# EAGLE board RectangularThing R2 (EAGLE 7.7.0)
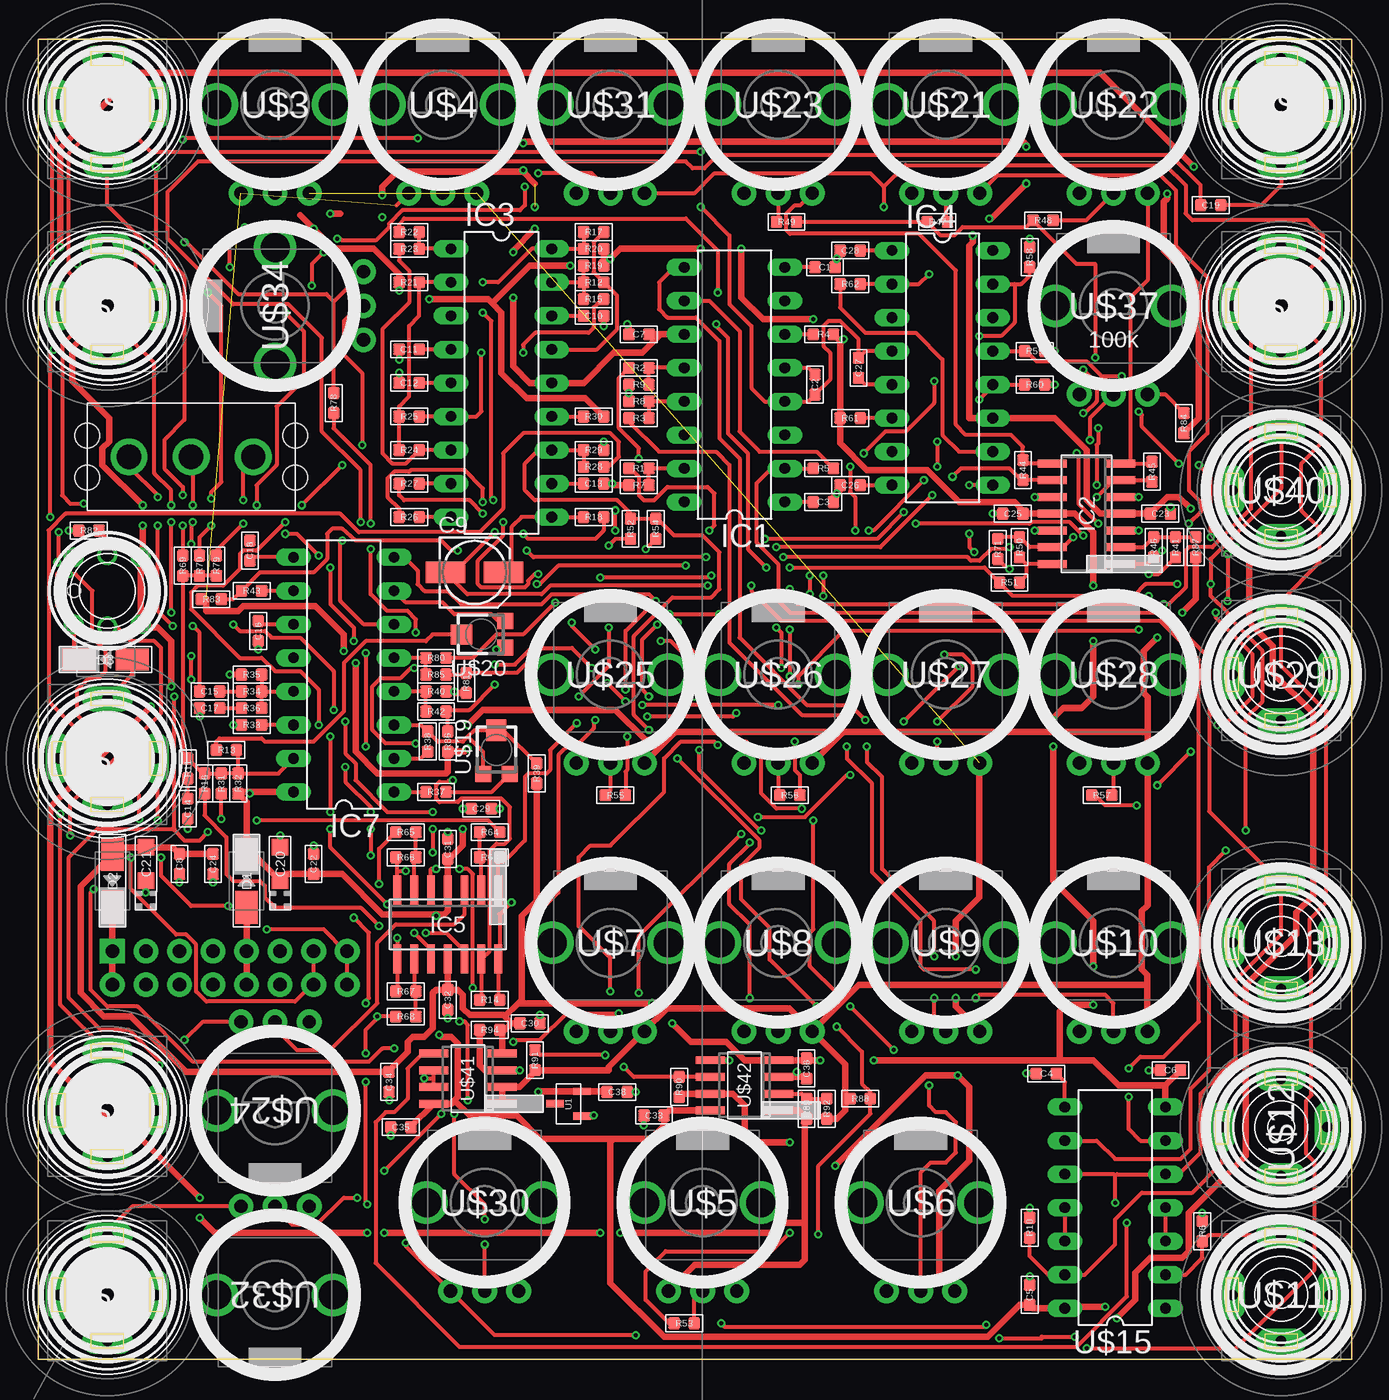
[diagram p6: board, top side]
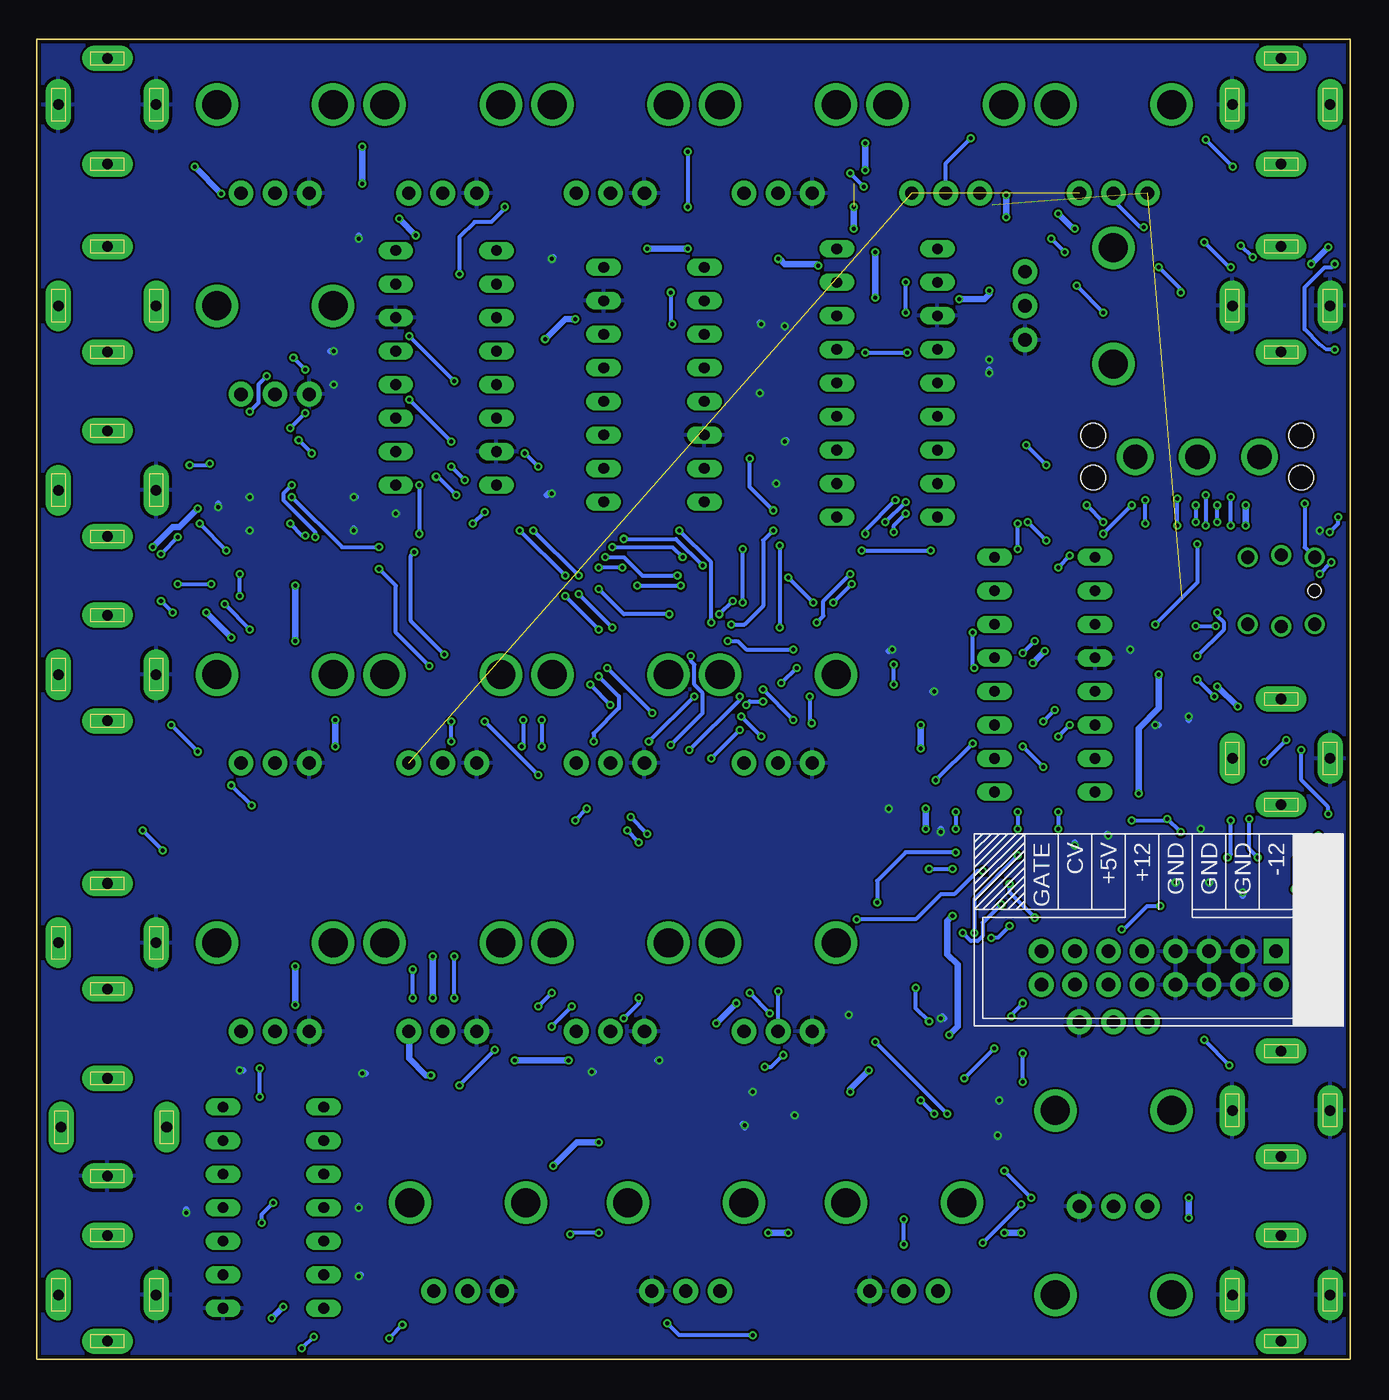
[diagram p7: board, bottom side, seen from below]

Size 99.5 x 100 mm. Coordinates in mm from the lower left corner, seen from the top.
Copper layers (1*16): Top 0.035mm / dielectric 1.5mm / Bottom 0.035mm
Design rules "ITEADstudio_DRC": minimum track width 6mil, minimum drill 12mil, track to track 6mil, track to pad 6mil, pad to pad 6mil, via to via 6mil, smd to smd 0mil, copper to edge 10mil, drill to drill 10mil, minimum pad ring 10mil, minimum via ring 6mil, stop-mask expansion 2mil, vias tented up to drill 100mil, thermal gap 10mil
Net classes: 0 default: width 0.305 mm; 1 power: width 0.508 mm; 3 groundplane: width 0.203 mm, clearance 0.203 mm

## Footprints (pad centres in the part's own frame; a part is rotated, then mirrored left to right if it is on the bottom)
C0603 = smd 0.889 x 0.889: 1 -0.762,0; 2 0.762,0
153CLV-0505 = smd 3 x 1.6: + 2.2,0; - -2.2,0
AVX-A = smd 1.27 x 1.27: + -1.27,0; - 1.27,0
DO-214AC = smd 2.5 x 1.7: 1 -2,0; 2 2,0
DIL16 = drill 0.813 long: 1 -8.89,-3.81; 2 -6.35,-3.81; 3 -3.81,-3.81; 4 -1.27,-3.81; 5 1.27,-3.81; 6 3.81,-3.81; 7 6.35,-3.81; 8 8.89,-3.81; 9 8.89,3.81; 10 6.35,3.81; 11 3.81,3.81; 12 1.27,3.81; 13 -1.27,3.81; 14 -3.81,3.81; 15 -6.35,3.81; 16 -8.89,3.81
SO14 = smd 0.6 x 2.2: 1 -3.81,-2.6; 2 -2.54,-2.6; 3 -1.27,-2.6; 4 0,-2.6; 5 1.27,-2.6; 6 2.54,-2.6; 7 3.81,-2.6; 8 3.81,2.6; 9 2.54,2.6; 10 1.27,2.6; 11 0,2.6; 12 -1.27,2.6; 13 -2.54,2.6; 14 -3.81,2.6
DIL18 = drill 0.813 long: 1 -10.16,-3.81; 2 -7.62,-3.81; 3 -5.08,-3.81; 4 -2.54,-3.81; 5 0,-3.81; 6 2.54,-3.81; 7 5.08,-3.81; 8 7.62,-3.81; 9 10.16,-3.81; 10 10.16,3.81; 11 7.62,3.81; 12 5.08,3.81; 13 2.54,3.81; 14 0,3.81; 15 -2.54,3.81; 16 -5.08,3.81; 17 -7.62,3.81; 18 -10.16,3.81
R0603 = smd 0.889 x 0.889: 1 -0.762,0; 2 0.762,0
SOT95P237X112-3N = smd 1.321 x 0.559: 1 -1.016,0.94; 2 -1.016,-0.94; 3 1.016,0
POWER_16_SHROUDED = drill 1.016 pad 1.88 square: 1 -8.89,-1.27 | drill 1.016 pad 1.88: 2 -8.89,1.27; 3 -6.35,-1.27; 4 -6.35,1.27; 5 -3.81,-1.27; 6 -3.81,1.27; 7 -1.27,-1.27; 8 -1.27,1.27; 9 1.27,-1.27; 10 1.27,1.27; 11 3.81,-1.27; 12 3.81,1.27; 13 6.35,-1.27; 14 6.35,1.27; 15 8.89,-1.27; 16 8.89,1.27
OG-POTS_ALPS_POT_VERTICAL = drill 1 pad 1.88: P$1 -2.58,-6.7; P$2 0,-6.7; P$3 2.58,-6.7 | drill 2.2 pad 3.175: P$4 4.4,0; P$5 -4.4,0
3.5MM-JACK-SWITCH-13MM-OUTPUT = drill 0.8 pad 1.93 long: RING@3 -3.7,0; SECOND@3 0,-3.5; SWITCH@3 3.7,0; TIP@3 0,4.5
3.5MM-JACK-SWITCH-13MM-INPUT = drill 0.8 pad 1.93 long: RING@3 -3.7,0; SECOND@3 0,-3.5; SWITCH@3 3.7,0; TIP@3 0,4.5
DIL14 = drill 0.813 long: 1 -7.62,-3.81; 2 -5.08,-3.81; 3 -2.54,-3.81; 4 0,-3.81; 5 2.54,-3.81; 6 5.08,-3.81; 7 7.62,-3.81; 8 7.62,3.81; 9 5.08,3.81; 10 2.54,3.81; 11 0,3.81; 12 -2.54,3.81; 13 -5.08,3.81; 14 -7.62,3.81
TC33X = smd 1.2 x 1.2: 1 -1,-1.825; 3 1,-1.825 | smd 1.5 x 1.6: 2 0,1.5
MULTICOMP1MS-ONOFFON = drill 1.85: 1 -4.7,0; 2 0,0; 3 4.7,0 | hole 1.85: -7.875,1.59; -7.875,-1.59; 7.875,1.59; 7.875,-1.59
PB6149L = drill 1: 1 2.54,2.54; 2 2.54,-2.54; 3 -2.54,2.54; 4 -2.54,-2.54; LEDNEG 0,-2.7; LEDPOS 0,2.7 | hole 1: 2.54,0
SO08 = smd 0.6 x 2.2: 1 -1.905,-2.6; 2 -0.635,-2.6; 3 0.635,-2.6; 4 1.905,-2.6; 5 1.905,2.6; 6 0.635,2.6; 7 -0.635,2.6; 8 -1.905,2.6

## Placement (x,y rotation side)
C1  0.02uF  [C0603]  59.6,82.73 180 top
C2  0.02uF  [C0603]  58.84,73.84 90 top
C3  0.039uF  [C0603]  59.48,64.95 180 top
C4  5nF  [C0603]  76.37,21.64 180 top
C5  100nF  [C0603]  75.1,4.87 270 top
C6  100nF  [C0603]  85.77,21.89 180 top
C7  100nF  [C0603]  45.51,77.65 0 top
C8  100nF  [C0603]  10.71,37.51 270 top
C9  1uF  [153CLV-0505]  33.06,59.61 0 top
C10  300pF  [C0603]  42.08,79.04 0 top
C11  300pF  [C0603]  28.11,76.5 0 top
C12  300pF  [C0603]  28.11,73.96 0 top
C13  300pF  [C0603]  42.08,66.34 0 top
C14  0.01uF  [C0603]  11.34,41.7 90 top
C15  100nF  [C0603]  12.99,50.59 180 top
C16  1000pF  [C0603]  16.68,55.17 270 top
C17  0.01uF  [C0603]  12.99,49.32 0 top
C18  0.001uF  [C0603]  16.04,61.26 270 top
C19  0.001uF  [C0603]  88.81,87.42 0 top
C20  10uF  [AVX-A]  18.33,37.51 90 top
C21  10uF  [AVX-A]  8.17,37.51 90 top
C22  100nF  [C0603]  20.87,37.51 90 top
C23  100nF  [C0603]  85,64.06 0 top
C24  100nF  [C0603]  13.25,37.51 90 top
C25  100nF  [C0603]  73.83,64.06 180 top
C26  0.02uF  [C0603]  61.51,66.22 0 top
C27  0.02uF  [C0603]  62.14,75.11 270 top
C28  0.039uF  [C0603]  61.51,84 0 top
C29  100nF  [C0603]  33.57,41.7 180 top
C30  100nF  [C0603]  37.25,25.45 0 top
C31  100nF  [C0603]  31.03,38.66 90 top
C32  100nF  [C0603]  31.03,27.23 270 top
C33  100nF  [C0603]  46.65,18.46 0 top
C34  100nF  [C0603]  26.58,21 270 top
C35  100nF  [C0603]  27.47,17.57 0 top
C36  100nF  [C0603]  58.21,22.02 270 top
C38  100nF  [C0603]  43.86,20.24 180 top
D1  [DO-214AC]  15.79,36.24 90 top
D2  [DO-214AC]  5.63,36.24 270 top
D3  [DO-214AC]  5.12,53.01 180 top
IC1  CEM3310  [DIL16]  52.75,73.84 90 top
IC2  TL074D  [SO14]  79.42,64.06 90 top
IC3  CEM3320  [DIL18]  35.09,73.96 270 top
IC4  CEM3310  [DIL16]  68.49,75.11 270 top
IC5  TL074D  [SO14]  31.03,32.94 180 top
IC7  CEM3340  [DIL16]  23.15,51.86 90 top
R1  10k  [R0603]  45.51,67.48 180 top
R2  10k  [R0603]  45.51,75.11 180 top
R3  10k  [R0603]  45.51,71.3 180 top
R4  470  [R0603]  59.48,77.65 0 top
R5  24k  [R0603]  59.48,67.48 180 top
R6  47k  [R0603]  88.18,9.7 90 top
R7  470  [R0603]  45.51,66.22 180 top
R8  470  [R0603]  45.51,72.57 180 top
R9  470  [R0603]  45.51,73.84 0 top
R10  47k  [R0603]  75.1,9.95 90 top
R11  470  [R0603]  11.34,44.75 270 top
R12  100k  [R0603]  42.08,81.58 180 top
R13  1M  [R0603]  14.26,46.15 180 top
R14  22k  [R0603]  34.2,27.23 0 top
R15  91k  [R0603]  42.08,80.31 180 top
R16  100k  [R0603]  12.61,43.61 90 top
R17  91k  [R0603]  42.08,85.39 180 top
R18  100k  [R0603]  42.08,63.8 0 top
R19  220k  [R0603]  42.08,82.85 0 top
R20  220k  [R0603]  42.08,84.12 0 top
R21  220k  [R0603]  28.11,81.58 0 top
R22  91k  [R0603]  28.11,85.39 180 top
R23  100k  [R0603]  28.11,84.12 180 top
R24  91k  [R0603]  28.11,68.88 0 top
R25  100k  [R0603]  28.11,71.42 0 top
R26  100k  [R0603]  28.11,63.8 180 top
R27  51k  [R0603]  28.11,66.34 0 top
R28  100k  [R0603]  42.08,67.61 180 top
R29  1.8k  [R0603]  42.08,68.88 0 top
R30  1.8k  [R0603]  42.08,71.42 180 top
R31  100k  [R0603]  13.88,43.61 90 top
R32  360k  [R0603]  15.15,43.61 90 top
R33  1.8k  [R0603]  16.17,48.05 0 top
R34  1M  [R0603]  16.17,50.59 0 top
R35  1.5M  [R0603]  16.17,51.86 0 top
R36  470  [R0603]  16.17,49.32 180 top
R37  24k  [R0603]  30.14,42.97 0 top
R38  5.6k  [R0603]  29.5,46.78 90 top
R39  820  [R0603]  37.76,44.37 270 top
R40  10k  [R0603]  30.14,50.59 0 top
R41  10k  [R0603]  86.15,61.52 90 top
R42  10k  [R0603]  30.14,49.07 0 top
R43  10k  [R0603]  16.17,58.21 180 top
R44  20k  [R0603]  74.59,67.36 90 top
R45  10k  [R0603]  84.37,67.23 90 top
R46  10k  [R0603]  84.5,61.52 270 top
R47  10k  [R0603]  68.11,86.15 180 top
R48  10k  [R0603]  76.11,86.28 180 top
R49  10k  [R0603]  56.68,86.15 0 top
R50  10k  [R0603]  74.34,61.52 270 top
R51  10k  [R0603]  73.57,58.85 180 top
R52  100k  [R0603]  44.87,62.91 90 top
R53  100k  [R0603]  48.94,2.72 180 top
R54  100k  [R0603]  46.78,62.91 90 top
R55  10k  [R0603]  43.73,42.72 180 top
R56  10k  [R0603]  56.94,42.72 180 top
R57  10k  [R0603]  80.56,42.72 0 top
R58  470  [R0603]  75.1,83.49 90 top
R59  470  [R0603]  75.48,76.38 0 top
R60  470  [R0603]  75.48,73.84 180 top
R61  470  [R0603]  61.51,71.3 180 top
R62  24k  [R0603]  61.51,81.45 0 top
R63  22k  [R0603]  34.2,38.02 0 top
R64  22k  [R0603]  34.2,39.93 180 top
R65  22k  [R0603]  27.85,39.93 0 top
R66  22k  [R0603]  27.85,38.02 180 top
R67  22k  [R0603]  27.85,27.86 180 top
R68  22k  [R0603]  27.85,25.96 0 top
R69  100k  [R0603]  10.96,60.12 270 top
R70  1M  [R0603]  12.23,60.12 270 top
R71  10k  [R0603]  72.69,61.39 90 top
R78  22k  [R0603]  22.39,72.44 270 top
R79  100k  [R0603]  13.5,60.12 270 top
R80  100k  [R0603]  30.14,53.13 0 top
R81  100k  [R0603]  32.43,51.23 270 top
R82  1k  [R0603]  3.85,62.79 180 top
R83  20k  [R0603]  13.12,57.58 0 top
R84  140k  [R0603]  86.78,70.91 270 top
R85  560k  [R0603]  30.14,51.86 180 top
R86  10k  [R0603]  31.03,46.78 90 top
R87  10k  [R0603]  87.67,61.52 90 top
R88  BIAS  [R0603]  62.27,19.73 0 top
R89  200k  [R0603]  58.21,18.97 270 top
R90  100k  [R0603]  48.55,20.62 270 top
R91  100k  [R0603]  37.63,22.65 90 top
R92  100k  [R0603]  59.73,18.97 90 top
R94  10k  [R0603]  34.2,24.94 180 top
U1  LM4040DIM3-5.0  [SOT95P237X112-3N]  40.17,19.35 180 top
U$1  EURORACK_PCB20HP_10X10CM  [EURORACK20HP_10X10CM]  -0.34,-3 0 top
U$2  POWERSHROUDED  [POWER_16_SHROUDED]  14.52,29.64 180 bottom
U$3  [OG-POTS_ALPS_POT_VERTICAL]  17.95,95.04 0 top
U$4  [OG-POTS_ALPS_POT_VERTICAL]  30.65,95.04 0 top
U$5  [OG-POTS_ALPS_POT_VERTICAL]  50.33,11.86 0 top
U$6  [OG-POTS_ALPS_POT_VERTICAL]  66.84,11.86 0 top
U$7  [OG-POTS_ALPS_POT_VERTICAL]  43.35,31.54 0 top
U$8  [OG-POTS_ALPS_POT_VERTICAL]  56.05,31.54 0 top
U$9  [OG-POTS_ALPS_POT_VERTICAL]  68.75,31.54 0 top
U$10  [OG-POTS_ALPS_POT_VERTICAL]  81.45,31.54 0 top
U$11  PJ-341  [3.5MM-JACK-SWITCH-13MM-OUTPUT]  94.15,4.87 0 top
U$12  PJ-341  [3.5MM-JACK-SWITCH-13MM-OUTPUT]  94.15,17.57 90 top
U$13  PJ-341  [3.5MM-JACK-SWITCH-13MM-OUTPUT]  94.15,31.54 0 top
U$14  PJ-341  [3.5MM-JACK-SWITCH-13MM-INPUT]  5.25,45.51 0 top
U$15  CEM3360  [DIL14]  81.58,11.48 90 top
U$16  PJ-341  [3.5MM-JACK-SWITCH-13MM-INPUT]  5.25,18.84 0 top
U$17  PJ-341  [3.5MM-JACK-SWITCH-13MM-INPUT]  94.15,95.04 180 top
U$18  PJ-341  [3.5MM-JACK-SWITCH-13MM-INPUT]  5.25,95.04 180 top
U$19  [TC33X]  34.71,46.15 0 top
U$20  [TC33X]  33.57,54.91 90 top
U$21  [OG-POTS_ALPS_POT_VERTICAL]  68.75,95.04 0 top
U$22  [OG-POTS_ALPS_POT_VERTICAL]  81.45,95.04 0 top
U$23  [OG-POTS_ALPS_POT_VERTICAL]  56.05,95.04 0 top
U$24  [OG-POTS_ALPS_POT_VERTICAL]  17.95,18.84 180 top
U$25  [OG-POTS_ALPS_POT_VERTICAL]  43.35,51.86 0 top
U$26  [OG-POTS_ALPS_POT_VERTICAL]  56.05,51.86 0 top
U$27  [OG-POTS_ALPS_POT_VERTICAL]  68.75,51.86 0 top
U$28  [OG-POTS_ALPS_POT_VERTICAL]  81.45,51.86 0 top
U$29  PJ-341  [3.5MM-JACK-SWITCH-13MM-OUTPUT]  94.15,51.86 0 top
U$30  [OG-POTS_ALPS_POT_VERTICAL]  33.82,11.86 0 top
U$31  [OG-POTS_ALPS_POT_VERTICAL]  43.35,95.04 0 top
U$32  [OG-POTS_ALPS_POT_VERTICAL]  17.95,4.87 180 top
U$33  PJ-341  [3.5MM-JACK-SWITCH-13MM-INPUT]  5.25,4.87 0 top
U$34  [OG-POTS_ALPS_POT_VERTICAL]  17.95,79.8 90 top
U$35  ONOFFON  [MULTICOMP1MS-ONOFFON]  11.6,68.37 0 top
U$36  PJ-341  [3.5MM-JACK-SWITCH-13MM-INPUT]  5.25,79.8 0 top
U$37  100k  [OG-POTS_ALPS_POT_VERTICAL]  81.45,79.8 0 top
U$38  PJ-341  [3.5MM-JACK-SWITCH-13MM-INPUT]  94.15,79.8 0 top
U$39  SWITCH_W_LED_PB6149L-X-102YELLOW  [PB6149L]  5.25,58.21 180 top
U$40  PJ-341  [3.5MM-JACK-SWITCH-13MM-OUTPUT]  94.15,65.83 0 top
U$41  TL072  [SO08]  32.55,21.26 90 top
U$42  TL072  [SO08]  53.51,20.75 90 top

## Tracks (layer width: path | path; a pad name or v marks a point on that pad's centre or on a via)
5V  (via drill 0.3)  (2 unrouted)
  Top 0.508: R90.2 48.81,20.11 U$42.7 52.62,20.11 53.51,19.23 53.51,17.19 54.27,16.43 v56.94,16.43 | U$9.P$3 71.33,24.9 69.51,26.72 v69.51,27.35 | U$27.P$3 71.29,45.12 71.29,34.97 69.51,33.2 v69.51,30.53 | v60.37,14.65 67.22,21.51 v69.64,21.51 70.53,20.62 70.53,15.03 68.24,12.75 68.24,6.4 69.42,5.21 U$6.P$3
  Bottom 0.508: v69.51,27.35 v69.51,30.53 | v56.94,16.43 58.59,16.43 v60.37,14.65 | v69.64,21.51 70.02,21.51 71.29,22.78 71.29,24.8 U$9.P$3
10V  (via drill 0.3)
  Top 0.508: U$42.1 57.57,18.84 R89.2 58.08,18.08 58.08,10.33 | R84.2 87.93,71.3 87.93,81.33 85.26,84 85.26,87.68 85.51,87.93 v85.51,88.31 | v87.54,90.34 80.43,97.46 7.41,97.46 1.69,91.74 v1.69,84.25 | v7.92,64.69 4.87,67.74 4.87,69.01 5.38,69.52 5.38,71.3 2.58,74.09 2.58,76.63 4.36,78.41 4.36,81.58 v2.96,82.98 | v7.92,63.17 7.92,60.88 U$39.4 U$39.3 8.04,55.42 9.06,55.42 10.07,54.4 v10.07,50.97 | v12.23,10.72 13.38,9.57 v24.93,9.57 | v12.23,12.24 7.15,17.32 6.14,17.32 0.93,22.53 0.93,41.83 v8.55,49.45 | 58.08,10.33 56.43,10.33 55.67,9.57 v44.11,9.57 | v26.2,9.57 v42.59,9.57 | U$5.P$1 49.75,7.16 57.7,7.16 58.08,7.54 58.08,10.33
  Bottom 0.508: v87.54,90.34 v85.51,88.31 | v2.96,82.98 v1.69,84.25 | v7.92,63.17 v7.92,64.69 | v12.23,12.24 v12.23,10.72 | v42.59,9.57 v44.11,9.57 | v24.93,9.57 v26.2,9.57 | v8.55,49.45 v10.07,50.97
12V  (via drill 0.3)  (1 unrouted)
  Top 0.508: IC1.11 47.16,77.65 | 47.16,77.65 C7.2 | IC7.16 16.04,42.97 | 16.04,42.97 15.28,42.97 R32.1 15.79,42.21 D1.2 16.33,38.24 C20.+ 18.84,36.75 C22.1 23.03,36.75 26.08,33.7 30.14,33.7 | 30.14,33.7 30.77,33.7 31.03,33.96 IC5.4 C31.1 31.16,37.89 32.17,38.91 v32.17,40.18 | C35.2 28.23,17.63 U$41.8 31.28,19.35 31.54,19.61 | 31.54,19.61 31.79,19.86 31.79,23.92 31.28,24.43 30.52,24.43 v30.39,24.56 | 43.6,16.69 38.01,16.69 36.24,18.46 32.68,18.46 31.54,19.61 | 47.16,77.65 45.76,76.25 43.6,76.25 41.32,73.96 IC3.14 37.25,73.96 35.98,75.23 v35.98,80.44 | v26.08,88.19 26.08,88.82 27.22,89.96 36.74,89.96 | 36.74,89.96 37.63,89.08 | v32.17,41.7 C29.2 | v35.98,83.87 35.98,84 v37.63,85.65 | 43.6,16.69 43.35,16.43 43.35,5.76 47.41,1.7 71.92,1.7 74.34,4.11 C5.2 75.35,3.86 U$15.14 77.89,3.98 v80.81,3.98 | 74.84,92 v74.84,91.87 74.72,92.12 74.59,92.25 36.74,92.25 v36.74,92.12 | v74.84,89.08 72.18,86.41 v72.05,86.41 | v70.78,85.14 70.78,84.63 70.53,84.38 70.53,71.3 IC4.11 77,71.3 79.42,68.88 79.42,65.07 80.43,64.06 IC2.4 C23.1 85.51,65.33 86.4,65.33 v87.29,64.44 | v36.74,90.09 36.74,89.96 | v14.52,51.86 R35.1 | v16.04,42.85 16.04,42.97 | v30.14,33.58 30.14,33.7 | 43.6,16.69 46.4,16.69 47.41,17.7 C33.2 47.79,18.84 U$42.8 | v81.7,3.1 83.1,4.49 83.1,6.53 84.24,7.67 86.66,7.67 87.16,8.18 87.16,11.1 91.48,15.42 91.48,28.37 95.29,32.18 95.29,33.83 96.56,35.1 96.56,48.94 93.51,51.99 93.51,54.02 91.73,55.8 91.73,60.5 v90.72,61.52
  Bottom 0.508: v26.08,86.54 v26.08,88.19 | v32.17,40.18 v32.17,41.7 | v35.98,80.44 v35.98,83.87 | v37.63,85.65 v37.63,87.3 | v74.84,89.08 v74.84,91.87 | v70.78,85.14 v72.05,86.41 | v36.74,92.12 v36.74,90.09 | v14.52,51.86 14.52,49.32 16.04,47.8 v16.04,42.85 | IC3.14 38.78,73.96 | v80.81,3.98 v81.7,3.1 | v87.29,64.44 88.69,63.04 89.2,63.04 v90.72,61.52 | v30.39,24.56 29.76,25.19 29.76,29.89 30.52,30.66 30.52,33.2 v30.14,33.58
-5V  (via drill 0.3)  (2 unrouted)
  Top 0.305: 27.15,87.42 U$4.P$1
  Top 0.508: 83.99,28.37 83.99,29.13 83.61,29.51 83.61,33.96 84.03,34.38 U$28.P$3 84.03,47.51 | 83.99,28.37 83.99,24.88 U$10.P$3 | 84.03,47.51 84.03,50.17 83.73,50.47 83.73,53.64 v84.75,54.66 | v86.66,56.56 87.67,57.58 R87.1 | R92.1 60.49,18.21 61.13,18.84 61.13,20.11 | 61.13,20.11 61.13,22.34 U$8.P$3 | U$8.P$3 56.88,26.59 47.67,26.59 U$7.P$3 43.22,22.14 43.22,21.89 R91.1 37.63,21.77 36.49,20.62 U$41.2 U$41.1 | 83.99,28.37 62.15,28.37 U$8.P$3 | 84.03,47.51 60.98,47.51 | 60.98,47.51 U$26.P$3 | 60.98,47.51 48.28,47.51 47.54,46.78 | 47.54,46.78 U$25.P$3 | v32.55,46.28 32.3,46.02 R86.1 31.03,44.5 30.9,44.37 25.7,44.37 24.04,46.02 v24.04,52.75 | v32.55,48.05 33.7,49.2 43.73,49.2 46.02,46.91 47.41,46.91 47.54,46.78 | R83.1 12.74,57.58 12.74,56.69 15.15,56.69 15.54,57.07 21,57.07 23.15,54.91 v23.15,53.64 | R88.1 61.13,20.11
  Bottom 0.508: v84.75,54.66 v86.66,56.56 | v32.55,48.05 v32.55,46.28 | v23.15,53.64 v24.04,52.75
-5VIN  (via drill 0.3)
  Top 0.508: R94.2 33.44,22.27 33.82,21.89 U$41.3 v36.49,21.89 | v37.89,20.24 37.94,20.29 U1.2 43.04,20.29 C38.2
  Bottom 0.508: v37.89,20.24 37.89,20.5 v36.49,21.89
-12V  (via drill 0.3)
  Top 0.508: U$41.4 35.15,24.75 | 35.15,24.75 35.85,25.45 | 35.85,25.45 C30.1 | IC5.11 C32.1 | C24.2 C8.1 10.2,38.78 C21.- 6.17,38.78 D2.1 3.22,35.83 3.22,27.73 4.99,25.96 7.03,25.96 11.22,21.77 C34.1 26.58,21.89 27.98,23.29 27.98,24.05 28.36,24.43 29.25,24.43 29.89,25.07 29.89,27.73 30.14,27.99 C32.1 | U$15.7 85.39,20.75 | 85.39,20.75 C6.1 | R19.2 42.84,83.36 | 42.84,83.36 R20.2 | 60.75,77.01 R61.2 60.75,69.39 62.78,67.36 67.35,67.36 69.76,64.95 73.96,64.95 74.59,64.31 C25.1 IC2.11 78.53,64.06 79.92,62.66 v79.92,58.59 | 60.75,77.01 60.75,77.14 R4.2 60.37,77.77 | 19.85,86.66 v20.87,85.65 22.39,84.12 25.44,84.12 27.35,82.22 R21.1 v27.35,80.95 | v22.14,86.79 22.9,86.79 | C32.1 31.79,27.99 32.17,27.61 32.17,26.59 32.68,26.08 35.22,26.08 35.35,25.96 | 35.35,25.96 35.85,25.45 | v48.05,25.45 49.44,24.05 52.11,24.05 53.51,22.65 U$42.4 58.08,22.65 C36.1 58.33,22.65 v59.22,22.65 | v46.52,26.97 36.36,26.97 | 36.36,26.97 35.35,25.96 | v29.63,80.31 34.08,80.31 34.39,79.99 | 34.39,79.99 35.09,79.3 35.09,74.72 37,72.82 41.44,72.82 R30.1 | 42.84,83.36 v43.35,83.36 44.11,84.12 v50.21,84.12 | v40.3,82.85 37.25,82.85 34.39,79.99 | 60.75,77.01 v61,77.26 | v58.71,78.79 54.91,78.79 53.25,80.44 v53.25,84.12 | 85.39,20.75 81.83,20.75 79.92,22.65 77.38,22.65 | 77.38,22.65 v63.29,22.65 | 77.38,22.65 77.38,26.34 77.89,26.85 v79.92,26.85 | v79.92,29.77 79.92,33.2 76.88,36.24 v76.88,46.4 | v76.88,48.43 76.88,48.56 77.64,49.32 79.04,49.32 79.92,50.21 v79.92,54.4 | R39.2 37.76,34.72 36.62,33.58 36.62,27.23 36.36,26.97 | R94.1 34.97,24.93 35.15,24.75
  Bottom 0.508: v20.87,85.65 21,85.65 v22.14,86.79 | v48.05,25.45 v46.52,26.97 | v27.35,80.95 27.35,80.69 27.73,80.31 v29.63,80.31 | v43.35,83.36 43.22,83.36 42.84,82.98 40.43,82.98 v40.3,82.85 | v61,77.26 59.48,78.79 v58.71,78.79 | v53.25,84.12 v50.21,84.12 | v63.29,22.65 v59.22,22.65 | v79.92,26.85 v79.92,29.77 | v76.88,46.4 v76.88,48.43 | v79.92,54.4 v79.92,58.59
A2_IN
  Top 0.305: U$25.P$2 43.35,43.1 R55.2
A_IN  (via drill 0.3)
  Top 0.305: R1.2 44.87,67.48 45.51,66.85 45.51,65.45 45.89,65.07 46.65,65.07 47.67,66.09 50.71,66.09 51.22,65.58 51.22,63.17 v50.84,62.79 | v43.35,27.86 43.35,30.4 40.94,32.81 40.94,38.02 41.82,38.91 43.35,38.91 47.41,42.97 47.41,45.51 48.68,46.78 51.22,46.78 v51.48,46.53 | v48.43,55.8 48.43,54.78 v49.95,53.26
  Bottom 0.305: U$7.P$2 v43.35,27.86 | v50.84,62.79 48.43,60.37 v48.43,55.8 | v49.95,53.26 49.95,52.88 49.7,52.63 49.7,51.1 49.06,50.47 49.06,48.94 v51.48,46.53
AMPENVELOPEOUT  (via drill 0.3)
  Top 0.305: R5.2 IC1.2 55.54,67.48 54.4,66.34 54.4,61.9 56.05,60.25 56.05,57.45 56.94,56.56 85.26,56.56 88.69,53.13 88.69,41.5 U$13.TIP@3 94.15,32.18 90.72,28.75 90.72,22.78 88.05,20.11 88.05,15.67 86.4,14.02 U$15.5 81.7,14.02 81.58,13.89 | U$15.10 81.45,14.02 81.58,13.89 | U$41.5 29.12,23.16 27.98,22.02 27.98,19.73 26.96,18.72 26.33,18.72 25.57,17.96 25.57,7.29 31.92,0.94 78.65,0.94 82.46,4.75 v82.46,10.33 | v81.58,11.86 81.58,13.89
  Bottom 0.305: v82.46,10.33 82.46,10.97 v81.58,11.86
CUTOFF_ENVELOPE  (via drill 0.3)
  Top 0.305: IC5.7 27.22,37 | 27.22,37 27.22,37.89 R66.2 | v46.02,61.39 R54.1 | v46.02,57.32 46.02,56.69 44.49,55.17 v44.49,50.72 | v37.38,33.32 39.41,35.35 39.41,45.77 40.3,46.66 40.94,46.66 42.08,47.8 42.08,48.31 v42.2,48.43 | 27.22,37 v27.85,37
  Bottom 0.305: v46.02,57.32 v46.02,61.39 | v42.2,48.43 v44.49,50.72 | v27.85,37 28.23,37 30.01,35.23 31.03,35.23 32.93,33.32 v37.38,33.32
CUTOFF_IN  (via drill 0.3)
  Top 0.305: R28.1 43.22,67.61 43.98,68.37 43.98,69.52 43.35,70.15 36.74,70.15 35.22,68.63 35.22,64.44 33.44,62.66 24.3,62.66 22.9,64.06 2.07,64.06 0.8,62.79 0.8,49.83 3.72,46.91 v3.72,46.15 | U$16.TIP@3 5.19,23.34 1.69,26.85 v1.69,41.32
  Bottom 0.305: v1.69,41.32 1.69,41.83 3.72,43.86 v3.72,46.15
CUTOFF_INPUT  (via drill 0.3)
  Top 0.305: R28.2 R29.1 IC3.12 37.89,68.88 36.87,67.87 36.87,65.83 37.63,65.07 43.86,65.07 44.87,64.06 R52.2 R54.2 46.9,63.68 48.17,62.4 50.33,62.4 51.6,61.13 51.6,58.34 50.97,57.71 48.05,57.71 45.13,54.78 45.13,48.82 v46.27,47.67 | R53.2 47.79,2.72 46.02,4.49 46.02,6.65 47.54,8.18 55.54,8.18 v56.94,9.57 | v59.1,9.45 59.1,14.65 63.03,18.59 R88.2 63.03,20.24 62.4,20.88 62.4,23.29 v60.49,25.19 | v58.97,26.72 55.41,30.27 55.41,32.69 53.25,34.85 53.25,37.39 54.65,38.78 54.65,39.29 v48.43,45.51
  Bottom 0.305: v56.94,9.57 58.97,9.57 v59.1,9.45 | v60.49,25.19 v58.97,26.72 | v48.43,45.51 v46.27,47.67
CUTOFF_KEYTRACK  (via drill 0.3)
  Top 0.305: IC5.1 34.84,37.89 R63.2 35.6,38.02 36.87,39.29 36.87,44.12 37.12,44.37 38.52,44.37 38.78,44.62 38.78,46.15 v40.81,48.18 | R52.1 43.73,62.15 v43.22,61.64 | v43.22,55.42 43.22,52.5 v40.94,50.21
  Bottom 0.305: v43.22,61.64 v43.22,55.42 | v40.94,50.21 40.94,48.31 v40.81,48.18
CUTOFF_KNOB
  Top 0.305: R53.1 49.7,4.52 U$5.P$2
CV_RACK  (via drill 0.3)
  Top 0.305: U$2.13 U$2.14 20.74,28.37 19.47,27.1 12.74,27.1 11.98,27.86 11.98,31.42 11.22,32.18 10.46,32.18 7.03,35.61 v7.03,38.02 | v1.18,82.98 1.06,83.11 1.06,92 1.44,92.38 1.44,95.04 U$18.SWITCH@3 | v1.18,76.5 0.93,76.25 v0.93,63.8 | v1.56,62.66 1.56,60.5 v1.44,60.37 | v2.33,59.48 2.83,59.48 4.1,58.21 4.1,54.66 5.12,53.64 5.12,52.12 4.61,51.61 3.85,51.61 2.96,50.72 2.96,48.82 v4.87,46.91 | v6.52,45.26 6.52,43.86 7.66,42.72 v7.66,40.94
  Bottom 0.305: v0.93,63.8 0.93,63.29 v1.56,62.66 | v2.33,59.48 v1.44,60.37 | v6.52,45.26 v4.87,46.91 | v7.66,40.94 7.66,38.66 v7.03,38.02 | v1.18,76.5 1.82,76.5 2.33,76.88 3.47,78.03 3.47,81.2 1.95,82.73 1.44,82.73 v1.18,82.98
D2_IN
  Top 0.305: U$26.P$2 56.05,42.85 R56.2
D_IN  (via drill 0.3)
  Top 0.305: R2.2 43.98,74.34 43.98,70.53 45.51,69.01 v45.51,68.25 | v43.73,62.79 v43.73,64.31 | v46.27,50.21 45.76,50.72 45.76,54.53 v46.9,55.67 | v50.08,46.15 50.08,44.62 54.65,40.05 v54.78,40.05 | v53.89,27.35 53.89,32.94 52.37,34.46 52.37,37.51 53.89,39.04 v53.89,39.16 | v55.03,25.83 56.05,24.81 U$8.P$2
  Bottom 0.305: v45.51,68.25 45.51,66.09 v43.73,64.31 | v46.27,50.21 46.27,49.96 v50.08,46.15 | v53.89,39.16 v54.78,40.05 | v53.89,27.35 53.89,26.97 v55.03,25.83 | v46.9,55.67 45.89,55.67 44.49,57.07 44.49,62.02 v43.73,62.79
EXP_FM_IN  (via drill 0.3)
  Top 0.305: R79.1 13.5,61.26 v15.54,63.29 | v15.54,65.07 15.54,67.61 U$35.3
  Bottom 0.305: v15.54,63.29 v15.54,65.07
FILTER_OUT  (via drill 0.3)
  Top 0.305: v82.59,19.86 82.59,17.45 83.48,16.56 U$15.6 | v82.59,22.02 83.48,22.91 85.26,22.91 87.93,25.58 87.93,53.01 85,55.93 56.3,55.93 54.02,58.21 v54.02,58.59 | v34.59,62.66 31.54,59.61 C9.- 32.51,57.96 38.14,57.96 38.78,58.59 v50.71,58.59 | v33.7,64.06 32.68,65.07 27.73,65.07 27.35,65.45 R27.1
  Bottom 0.305: v82.59,19.86 v82.59,22.02 | v34.59,62.66 34.59,63.17 v33.7,64.06 | v54.02,58.59 v50.71,58.59
GATE_IN  (via drill 0.3)
  Top 0.305: IC4.4 62.65,76.38 C27.1 62.14,77.26 60.75,78.66 59.86,78.66 59.48,78.28 59.48,76.76 59.98,76.25 59.98,74.22 C2.1 58.33,72.57 IC1.4 55.03,72.57 54.02,73.58 54.02,78.28 52.37,79.93 52.37,85.14 v50.21,87.3 | D3.2 3.25,52.88 3.72,52.88 2.71,53.9 U$39.1 2.71,55.8 1.44,57.07 1.44,59.48 U$39.2 3.22,60.75 | v50.21,91.49 8.55,91.49 7.28,92.76 3.72,92.76 2.33,91.36 2.33,82.34 3.6,81.07 3.6,78.66 1.82,76.88 1.82,65.45 2.45,64.82 v3.47,64.82
  Bottom 0.305: v50.21,91.49 v50.21,87.3 | v3.47,64.82 3.47,61.52 U$39.2
GATE_RACK  (via drill 0.3)
  Top 0.305: U$2.16 U$2.15 23.28,30.91 21.63,32.56 v17.31,32.56 | v9.06,40.81 9.06,45.51 U$14.SWITCH@3 | v9.31,38.02 9.31,36.62 11.6,34.34 v14.39,34.34
  Bottom 0.305: v9.06,40.81 9.06,38.27 v9.31,38.02 | v17.31,32.56 17.19,32.56 15.41,34.34 v14.39,34.34
GATELED  (via drill 0.3)
  Top 0.305: U$41.7 29.95,21.38 | 29.95,21.38 U$41.6 29.95,21.83 | v26.96,23.54 26.08,23.54 25.06,22.53 11.72,22.53 7.53,26.72 5.25,26.72 3.98,27.99 3.98,35.35 v4.23,35.61 | v2.45,39.67 2.45,42.09 9.31,48.94 9.31,53.9 8.8,54.4 7.03,54.4 5.92,55.51 U$39.LEDPOS | v29.25,21.26 29.83,21.26 29.95,21.38
  Bottom 0.305: v29.25,21.26 v26.96,23.54 | v4.23,35.61 4.23,37.89 v2.45,39.67
GND  (via drill 0.3)
  Top 0.508: C31.2 v31.03,39.93 | C32.2 v31.03,25.83 | C30.2 v38.01,26.08 | U$42.3 57.45,21.38 | 57.45,21.38 58.08,21.38 C36.2 | 57.45,21.38 v57.45,21.77 | U$42.5 v52.37,22.65 | C21.+ v8.17,35.35 | C8.2 v10.71,36.12 | C24.1 v13.25,36.12 | C20.- v18.33,39.67 | C22.2 v20.87,38.91 | R33.1 v14.77,48.05 | C17.1 v12.23,48.69 | C16.2 v16.68,53.77 | R40.2 v31.54,50.59 31.66,50.47 R81.2 | U$20.1 35.52,53.82 v34.71,53.77 | C1.1 60.37,83.23 v60.49,83.36 60.75,83.61 C28.1 | R58.2 v75.1,84.88 | R59.2 v77,76.38 | R60.1 v77,73.84 | C23.2 v85.77,64.56 | IC2.5 v83.35,65.33 | IC2.10 v75.48,65.33 | IC2.3 v83.35,62.79 | IC2.12 v75.48,62.79 | C5.1 v75.1,6.27 | R6.2 v88.18,11.1 | C6.2 v84.12,21.89 | C4.2 v74.84,21.64 | C7.1 44.74,78.28 v44.62,78.41 | C10.2 v42.84,78.28 | R9.1 v44.74,73.2 R8.2 | C25.2 v72.3,64.06 | C3.1 60.24,65.33 v60.49,65.58 60.75,65.83 C26.1 | C14.1 v11.34,40.18 | R29.2 v42.84,69.52 | C11.1 v27.35,75.74 | C12.1 v27.35,74.72 | C13.2 v43.48,66.34 43.6,66.22 R7.2 | C33.1 v45.89,17.7 | C34.2 v26.58,19.61 | C35.1 v26.71,16.94 | R10.2 v75.1,11.48 | R82.2 v2.33,62.79 | v34.97,41.7 C29.1 | U1.1 42.03,18.41 v42.08,18.46 | C38.1 v45.25,20.24
  Bottom 0.508: v31.03,39.93 31.03,40.18 | v31.03,25.83 30.9,25.96 30.77,25.83 | v38.01,26.08 38.01,25.96 | v57.45,21.77 57.32,21.77 | v52.37,22.65 52.49,22.65 | v8.17,35.35 8.17,35.1 | v10.71,36.12 10.71,35.99 | v13.25,36.12 13.25,35.99 | v18.33,39.67 18.46,39.8 | v20.87,38.91 20.87,39.16 | v14.77,48.05 14.52,48.05 | v12.23,48.69 12.23,48.43 | v16.68,53.77 16.68,53.64 | v31.54,50.59 31.66,50.59 | v34.71,53.77 34.97,53.64 | v60.49,83.36 60.37,83.49 | v75.1,84.88 75.1,85.14 | v77,76.38 77.26,76.38 | v77,73.84 77.13,73.84 | v85.77,64.56 85.77,64.82 | v83.35,65.33 83.48,65.33 | v75.48,65.33 75.35,65.33 | v83.35,62.79 83.48,62.79 | v75.48,62.79 75.48,62.91 | v75.1,6.27 74.97,6.4 | v88.18,11.1 88.18,11.35 | v84.12,21.89 83.86,21.89 | v74.84,21.64 74.59,21.64 | v44.62,78.41 44.74,78.53 | v42.84,78.28 42.84,78.15 | v44.74,73.2 44.62,73.2 | v72.3,64.06 72.18,64.06 | v60.49,65.58 60.75,65.58 60.87,65.45 | v11.34,40.18 11.34,40.05 | v42.84,69.52 42.71,69.64 | v27.35,75.74 27.35,75.61 | v27.35,74.72 27.35,74.98 | v43.48,66.34 43.6,66.34 | v45.89,17.7 45.89,17.57 46.02,17.83 | v26.58,19.61 26.58,19.48 | v26.71,16.94 26.71,16.81 | v75.1,11.48 75.1,11.61 | v2.33,62.79 2.33,62.66 | v42.08,18.46 42.2,18.46 | v45.25,20.24 45.38,20.24
  pour Bottom: -1.61,103.05 103.29,103.05 103.29,-4.65 -3.01,-4.65 -3.01,101.9
HARDSYNC_IN
  Top 0.305: U$17.TIP@3 94.15,88.95 92.62,87.42 C19.2
LINEAR_FM_IN  (via drill 0.3)
  Top 0.305: C15.2 12.23,55.04 v11.72,55.55 | v10.2,55.55 9.06,56.69 v9.06,63.17 | v9.06,65.33 9.06,65.45 7.03,67.48 7.03,68.25 U$35.1
  Bottom 0.305: v11.72,55.55 v10.2,55.55 | v9.06,63.17 v9.06,65.33
MAIN_CV  (via drill 0.3)
  Top 0.305: U$24.P$3 12.46,25.54 v11.09,24.18 | v9.18,22.27 9.18,22.65 6.9,24.94 4.74,24.94 2.33,27.35 2.33,38.02 4.49,40.18 10.2,40.18 10.26,40.12 | 10.26,40.12 11.09,39.29 12.23,39.29 v12.87,39.93 | v13.88,40.94 R31.1 | R64.1 34.08,40.81 v16.55,40.81 | U$18.TIP@3 5.25,87.42 v8.3,84.38 | v7.41,83.49 7.41,76.88 8.8,75.49 8.8,67.1 10.07,65.83 v10.07,64.69 | v10.07,56.56 v10.07,63.42 | v11.6,51.48 v11.6,53.26 | v10.33,50.21 10.33,40.18 10.26,40.12
  Bottom 0.305: v11.09,24.18 v9.18,22.27 | v12.87,39.93 v13.88,40.94 14.01,40.81 v16.55,40.81 | v7.41,83.49 v8.3,84.38 | v10.07,63.42 v10.07,64.69 | v10.07,56.56 10.07,56.31 9.57,55.8 9.57,55.29 v11.6,53.26 | v10.33,50.21 v11.6,51.48
MODENVOUT  (via drill 0.3)
  Top 0.305: R62.2 IC4.2 66.72,81.45 v67.48,82.22 | U$29.TIP@3 94.15,57.45 97.07,60.37 97.07,62.91 95.67,64.31 95.67,67.87 97.2,69.39 97.2,76.76 95.8,78.15 95.8,82.09 97.32,83.61 97.32,85.14 96.18,86.28 87.42,86.28 86.91,86.79 86.91,88.95 85.39,90.47 65.7,90.47 64.05,88.82 | 64.05,88.82 v64.05,87.3 | U$31.P$3 49.73,88.34 51.22,89.84 63.03,89.84 64.05,88.82 | R68.1 v25.7,25.96 25.7,25.83 24.81,24.94 v24.81,23.16 | v24.81,26.97 24.81,27.1 25.06,27.35 25.06,32.31 v23.92,33.45 | R65.1 25.82,38.66 v25.82,35.99 | v24.81,21 24.81,11.73 v24.93,11.73 | v72.81,1.57 75.99,1.57 75.99,1.7 v78.53,1.7 | v71.8,2.59 71.67,2.46 51.98,2.46 v51.73,2.72 | v79.42,0.81 90.72,0.81 96.69,6.78 96.69,14.91 96.05,15.54 96.05,19.61 96.43,19.99 96.43,29.51 96.31,29.64 96.31,33.32 97.58,34.59 97.58,49.07 94.15,52.5 U$29.TIP@3 | 94.28,56.31 U$29.TIP@3 | v27.85,8.81 27.85,8.55 U$30.P$1 34.58,1.83 v45.25,1.83
  Bottom 0.305: v64.05,87.3 64.05,87.17 65.07,86.15 66.34,86.15 67.48,85.01 v67.48,82.22 | v25.7,25.96 25.7,26.08 v24.81,26.97 | v23.92,33.45 25.82,35.35 v25.82,35.99 | v24.81,21 v24.81,23.16 | v27.85,8.81 v24.93,11.73 | v71.8,2.59 v72.81,1.57 | v78.53,1.7 v79.42,0.81 | v45.25,1.83 50.84,1.83 v51.73,2.72
N$1
  Top 0.305: R7.1 R1.1 IC1.15
N$2
  Top 0.305: R9.2 R2.1 IC1.12
N$3
  Top 0.305: IC1.13 R8.1 R3.1
N$4
  Top 0.305: C3.2 IC1.1
N$5
  Top 0.305: U$15.8 77.77,21 C4.1
N$6
  Top 0.305: IC1.5 58.33,75.11 C2.2
N$7
  Top 0.508: U$2.10 U$2.9 D1.1
N$8
  Top 0.508: D2.2 U$2.1 U$2.2
N$9
  Top 0.305: IC1.6 R4.1
N$10
  Top 0.305: C1.2 IC1.8
N$11
  Top 0.305: IC1.10 50.84,80.19 53.13,77.9 53.13,70.28 54.65,68.76 58.97,68.76 R5.1
N$12
  Top 0.305: U$15.4 U$15.3
N$13
  Top 0.305: U$15.2 86.91,6.4 88.18,7.67 R6.1 88.62,9.37 U$11.TIP@3
N$14
  Top 0.305: R10.1 75.1,7.79 76.5,6.4 U$15.13 79.29,6.4 81.58,8.68 81.58,10.59 83.61,12.62 87.42,12.62 89.7,14.91 89.7,17.52 U$12.TIP@3
N$15
  Top 0.305: U$15.11 U$15.12
N$16
  Top 0.305: C14.2 R11.2
N$17
  Top 0.305: IC3.16 C10.1
N$18
  Top 0.305: IC3.4 C11.2
N$19
  Top 0.305: IC3.5 C12.2
N$20
  Top 0.305: IC3.11 C13.1
N$21
  Top 0.305: IC3.9 R26.1
N$22
  Top 0.305: R82.1 5.25,62.15 U$39.LEDNEG
N$23
  Top 0.305: IC3.1 R23.1 R22.1
N$24
  Top 0.305: IC3.7 R24.2 27.85,67.87 26.84,67.87 26.08,68.63 26.08,78.03 28.11,80.06 28.11,82.47 27.35,83.23 R23.2
N$25  (via drill 0.3)
  Top 0.305: R25.2 IC3.6 33.19,71.42 33.57,71.8 v33.57,76.25 | R15.1 42.71,80.31 42.08,79.68 42.08,78.15 41.7,77.77 37.67,77.77 36.74,76.85 v36.74,76.25
  Bottom 0.305: v36.74,76.25 v33.57,76.25
N$26  (via drill 0.3)
  Top 0.305: R17.2 R20.1 IC3.18 37.38,84.12 34.84,81.58 v33.7,81.58 | R18.2 42.84,62.79 42.2,62.15 37.12,62.15 v36.74,62.53 | v34.46,65.07 34.33,65.2 34.33,78.66 v33.7,79.3
  Bottom 0.305: v36.74,62.53 36.74,62.79 v34.46,65.07 | v33.7,79.3 v33.7,81.58
N$27
  Top 0.305: IC3.17 R12.2 | R12.2 R19.1 | R12.2 R15.2
N$28
  Top 0.305: R17.1 42.08,84.63 42.08,82.34 R12.1 43.86,80.57 43.86,78.03 42.33,76.5 IC3.15
N$29
  Top 0.305: IC3.13 R30.2
N$30
  Top 0.305: R18.1 IC3.10 36.62,63.8 35.85,63.04 35.85,60.2 C9.+
N$31
  Top 0.305: C17.2 R36.2
N$32
  Top 0.305: IC3.8 R27.2
N$33
  Top 0.305: IC3.2 R21.2 28.87,79.04 28.11,78.28 28.11,72.95 27.35,72.18 R25.1 R24.1
N$34
  Top 0.305: R36.1 R34.2 | R35.2 R34.2 | R34.2 IC7.13
N$35
  Top 0.305: C15.1 R34.1
N$36
  Top 0.305: IC7.11 16.93,55.67 C16.1
N$37
  Top 0.305: IC7.9 16.3,60.75 C18.2
N$38
  Top 0.305: IC7.14 R33.2
N$39
  Top 0.305: IC2.14 74.84,60.25 | 74.84,60.25 R50.2 | 74.84,60.25 74.84,59.36 R51.1
N$40  (via drill 0.3)
  Top 0.305: R71.2 72.81,62.28 R50.1 75.1,61.52 IC2.13 76.88,61.64 77.77,61.64 v78.4,62.28 | R49.2 R47.2 68.37,85.14 69.38,85.14 70.02,85.77 74.84,85.77 R48.2 78.65,82.98 80.05,82.98 v80.05,75.87 | v80.18,66.22 80.18,69.26 80.31,69.39 v80.31,70.53 | v79.16,71.68 79.29,71.68 80.18,72.57 80.18,73.96 v79.16,74.98
  Bottom 0.305: v78.4,62.28 78.4,62.66 80.81,65.07 80.81,65.58 v80.18,66.22 | v79.16,71.68 v80.31,70.53 | v80.05,75.87 v79.16,74.98
N$41  (via drill 0.3)
  Top 0.305: R14.2 34.84,27.35 IC5.14 34.97,30.4 34.97,33.7 v35.85,34.59 | v29.89,40.18 v29.89,38.4 | v29.89,41.45 26.46,41.45 24.04,43.86 24.04,45.13 23.28,45.89 v23.28,48.31 | v22.39,49.2 22.39,52.12 19.85,54.66 17.69,54.66 17.19,55.17 15.28,55.17 v14.77,55.67 | v11.6,61.77 11.6,63.29 v11.72,63.42 | v11.72,64.69 11.72,68.25 U$35.2
  Bottom 0.305: v29.89,41.45 v29.89,40.18 | v22.39,49.2 v23.28,48.31 | v11.72,64.69 v11.72,63.42 | v11.6,61.77 11.6,58.85 v14.77,55.67 | v29.89,38.4 33.7,38.4 35.85,36.24 v35.85,34.59
N$42  (via drill 0.3)
  Top 0.305: C19.1 88.05,88.95 85.77,91.23 51.48,91.23 50.46,90.22 49.57,90.22 49.06,90.73 12.11,90.73 9.82,88.44 9.82,84.88 14.77,79.93 18.96,79.93 21.5,77.39 21.5,70.28 24.43,67.36 v24.43,63.42 | IC7.6 24.68,55.67 22.9,57.45 22.9,62.02 v23.03,62.02
  Bottom 0.305: v23.03,62.02 v24.43,63.42
N$43
  Top 0.305: IC7.1 R37.1
N$44
  Top 0.305: R37.2 34.36,42.97 U$19.3
N$45
  Top 0.305: IC7.3 29,48.05 R38.2 30.27,46.78 32.17,46.78 32.55,47.16 | 32.55,47.16 33.04,47.65 U$19.2 35.24,47.65 R39.1 | U$19.1 33.71,46.01 32.55,47.16
N$46
  Top 0.305: R13.2 13.5,46.78 13.76,47.04 16.93,47.04 17.19,46.78 20.87,46.78 23.15,49.07 23.15,52.75 24.81,54.4 29.38,54.4 29.89,54.91 U$20.2
N$47
  Top 0.305: IC7.2 29,45.51 R38.1
N$48
  Top 0.305: U$20.3 34.85,55.91 34.33,56.44 31.54,56.44 30.65,57.32 27.85,57.32 IC7.7
N$49
  Top 0.305: U$23.P$2 56.05,86.28 R49.1
N$50
  Top 0.305: R48.1 79.39,86.28 U$22.P$2
N$51
  Top 0.305: U$21.P$2 68.75,86.28 R47.1
N$52  (via drill 0.3)
  Top 0.305: IC2.1 83.99,60.25 R46.2 85,61.26 v85.13,61.26 | U$21.P$3 72.69,89.71 85,89.71 86.15,88.57 86.15,84.38 88.56,81.96 88.56,70.15 87.16,68.76 87.16,65.83 88.05,64.95 88.05,64.18 v87.16,63.29
  Bottom 0.305: v87.16,63.29 v85.13,61.26
N$53
  Top 0.305: IC2.7 82.59,67.87 | 82.59,67.87 84.24,67.87 R45.2 | U$22.P$3 84.03,81.75 82.72,80.44 82.72,67.99 82.59,67.87
N$54  (via drill 0.3)
  Top 0.305: R45.1 84.24,66.6 IC2.6 81.96,66.47 81.32,66.47 v80.18,65.33 | R86.2 31.03,48.94 | 31.03,48.94 R42.2 | v42.59,59.23 50.84,59.23 v50.97,59.36 | v56.43,60.75 70.4,60.75 70.65,60.5 71.29,60.5 72.18,61.39 73.45,61.39 v73.57,61.52 | 31.03,48.94 31.28,49.2 32.68,49.2 v34.59,51.1 | 40.68,56.94 v40.68,57.32 37.63,54.28 37.63,54.15 36.11,52.63 v34.59,52.63
  Bottom 0.305: v42.59,59.23 v40.68,57.32 | v50.97,59.36 53.63,59.36 55.03,60.75 v56.43,60.75 | v73.57,61.52 76.37,61.52 v80.18,65.33 | v34.59,51.1 v34.59,52.63
N$55
  Top 0.305: IC2.2 83.73,61.52 R46.1 R41.2 R87.2
N$56  (via drill 0.3)
  Top 0.305: IC2.9 R44.1 74.46,66.6 73.57,67.48 69.89,67.48 v69.26,66.85 | R83.2 14.77,57.58 R43.2 16.8,59.61 20.87,59.61 21.88,60.63 21.88,62.53 22.27,62.91 23.03,62.91 24.04,62.02 30.52,62.02 31.28,61.26 v31.79,61.26 | v67.73,65.45 63.8,61.52 v55.92,61.52 | v50.59,60.75 37.51,60.75 v37,61.26
  Bottom 0.305: v69.26,66.85 69.13,66.85 v67.73,65.45 | v55.92,61.52 51.35,61.52 v50.59,60.75 | v37,61.26 v31.79,61.26
N$57
  Top 0.305: IC2.8 74.84,67.87 R44.2 74.59,69.14 73.7,70.03 70.27,70.03 69.51,70.79 69.51,82.47 66.72,85.27 56.94,85.27 56.68,85.52 56.68,86.79 57.32,87.42 57.71,87.42 U$23.P$3
N$58  (via drill 0.3)
  Top 0.305: IC4.15 73.96,81.45 | 73.96,81.45 74.46,81.45 75.1,82.09 R58.1 | R55.1 44.49,44.5 44.62,44.62 v44.62,47.16 | v46.14,48.69 52.62,48.69 v52.87,48.94 | v56.3,52.37 56.3,55.04 v55.92,55.42 | v58.46,59.36 v58.46,57.96 | v61.89,62.79 61.89,65.33 61.51,65.71 v61.51,67.61 | v62.52,68.63 64.18,70.28 65.7,70.28 67.86,72.44 v67.86,74.09 | v71.29,77.52 72.94,77.52 73.96,78.53 73.96,81.45
  Bottom 0.305: v46.14,48.69 v44.62,47.16 | v56.3,52.37 v52.87,48.94 | v58.46,57.96 v55.92,55.42 | v61.89,62.79 v58.46,59.36 | v62.52,68.63 v61.51,67.61 | v71.29,77.52 v67.86,74.09
N$59  (via drill 0.3)
  Top 0.305: R60.2 IC4.12 72.3,73.71 v71.29,72.69 | R56.1 57.7,44.24 57.32,44.62 v57.32,46.78 | v56.94,55.29 v56.94,51.74 | v59.48,59.36 v59.48,57.83 | v62.91,62.79 63.29,62.79 v67.1,66.6 | v68.11,69.52 v68.11,67.61
  Bottom 0.305: v57.32,46.78 57.32,47.42 55.41,49.32 55.41,50.21 v56.94,51.74 | v59.48,57.83 v56.94,55.29 | v62.91,62.79 v59.48,59.36 | v68.11,67.61 v67.1,66.6 | v71.29,72.69 v68.11,69.52
N$60  (via drill 0.3)
  Top 0.305: IC4.13 R59.1 74.84,76.38 75.61,75.61 79.42,75.61 80.56,74.47 v82.08,74.47 | R57.1 80.05,42.72 80.81,41.96 v83.23,41.96 | v87.29,46.02 v84.75,43.48 | v90.08,61.01 v90.08,57.45 | v88.81,62.28 88.81,66.85 v87.93,67.74 | v86.4,67.87 83.61,70.66 83.61,71.55 v83.35,71.8 | v89.32,48.05 89.83,48.05 91.99,50.21 91.99,53.39 89.2,56.18 v89.2,56.56
  Bottom 0.305: v84.75,43.48 v83.23,41.96 | v89.32,48.05 v87.29,46.02 | v90.08,57.45 v89.2,56.56 | v88.81,62.28 v90.08,61.01 | v83.35,71.8 82.72,72.44 82.72,73.84 v82.08,74.47 | v87.93,67.74 86.53,67.74 v86.4,67.87
N$61
  Top 0.305: IC4.5 62.65,73.84 C27.2
N$62
  Top 0.305: IC4.6 R61.1
N$63
  Top 0.305: C26.2 IC4.8
N$64
  Top 0.305: R62.1 60.75,79.68 62.65,77.77 66.46,77.77 68.49,75.74 68.49,70.03 69.76,68.76 IC4.10
N$65
  Top 0.305: IC4.1 C28.2
N$66  (via drill 0.3)
  Top 0.305: R14.1 33.57,27.35 IC5.13 33.7,30.4 34.2,30.91 34.2,38.53 34.71,39.04 35.35,39.04 35.73,39.42 35.73,41.83 35.09,42.47 32.05,42.47 31.79,42.21 30.39,42.21 30.14,42.47 30.14,43.48 30.39,43.74 31.03,43.74 31.16,43.86 v31.41,43.86 | R78.2 22.39,70.53 25.19,67.74 v25.19,63.29 | v25.19,61.39 25.19,57.96 26.46,56.69 27.98,56.69 28.62,56.05 v28.62,55.04 | v28.49,52.37 28.23,52.37 27.47,51.61 25.95,51.61 25.31,50.97 25.31,47.67 26.33,46.66 v28.62,46.66
  Bottom 0.305: v25.19,61.39 v25.19,63.29 | v28.62,55.04 28.62,52.5 v28.49,52.37 | v31.41,43.86 v28.62,46.66
N$67
  Top 0.305: IC5.2 33.57,37.89 R63.1 R64.2
N$68
  Top 0.305: U$24.P$2 17.95,25.07 19.6,23.42 22.14,23.42 25.7,26.97 25.7,31.54 27.09,32.94 31.54,32.94 32.3,33.7 IC5.3
N$69
  Top 0.305: IC5.6 28.49,37.89 R66.1 R65.2
N$72
  Top 0.305: IC5.9 28.49,27.99 R67.1 R68.2
N$73  (via drill 0.3)
  Top 0.305: IC5.5 29.76,37.13 v30.14,37.13 | v31.92,37.13 32.55,37.13 32.93,36.75 v32.93,28.12 | v31.92,25.58 32.3,25.58 32.55,25.32 v32.55,19.61 | v31.54,18.59 31.54,14.02 33.82,11.73 v33.82,10.59 | U$30.P$2 v33.82,8.68
  Bottom 0.305: v31.92,37.13 v30.14,37.13 | v32.93,28.12 32.93,26.59 v31.92,25.58 | v31.54,18.59 v32.55,19.61 | v33.82,8.68 v33.82,10.59
N$75  (via drill 0.3)
  Top 0.305: v65.57,48.31 v69.76,52.5 | v61.51,44.24 61.26,44.24 58.08,41.07 v54.52,41.07 | v53.25,39.8 45.51,32.05 v45.51,27.73 | v43.98,26.21 40.05,26.21 38.01,24.18 36.11,24.18 v35.98,24.05 | v26.2,14.27 v30.52,18.59 | v24.17,12.24 23.15,12.24 21.12,10.21 19.22,10.21 17.95,11.48 U$32.P$2 | v73.57,59.86 73.45,59.86 R71.1
  Bottom 0.305: v69.76,52.5 72.3,55.04 72.3,58.59 v73.57,59.86 | v61.51,44.24 v65.57,48.31 | v53.25,39.8 v54.52,41.07 | v43.98,26.21 v45.51,27.73 | v30.52,18.59 v35.98,24.05 | v24.17,12.24 v26.2,14.27
N$76
  Top 0.305: U$32.P$3 7.12,11.57 4.74,9.19 5.07,9.19 U$33.TIP@3
N$78  (via drill 0.3)
  Top 0.305: IC5.10 29.76,31.04 v28.49,32.31 | v25.19,40.18 v25.19,38.15 | v25.19,41.45 25.19,41.83 23.28,43.74 v23.28,44.88 | v24.81,53.52 v24.81,46.4 | v23.92,54.4 23.92,55.42 22.14,57.2 v22.14,59.99 | v21.25,60.88 19.6,62.53 v18.71,62.53 | v16.55,64.69 16.55,66.22 18.07,67.74 18.07,72.18 20.11,74.22 20.11,77.9 v18.71,79.3 | v20.74,81.33 20.74,82.98 v21.63,83.87 | v22.65,84.88 22.9,84.88 23.03,84.76 25.57,84.76 26.58,85.77 26.58,86.03 27.6,87.04 36.49,87.04 36.87,87.42 v36.87,88.82 | v37.89,89.84 41.95,89.84 43.35,88.44 U$31.P$2
  Bottom 0.305: v28.49,32.31 28.49,34.85 v25.19,38.15 | v25.19,41.45 v25.19,40.18 | v24.81,46.4 v23.28,44.88 | v23.92,54.4 v24.81,53.52 | v21.25,60.88 v22.14,59.99 | v16.55,64.69 v18.71,62.53 | v20.74,81.33 v18.71,79.3 | v22.65,84.88 v21.63,83.87 | v37.89,89.84 v36.87,88.82
N$79  (via drill 0.3)
  Top 0.305: v28.74,92.5 11.09,92.5 v10.96,92.38 | v8.93,90.34 8.93,84.25 11.09,82.09 11.09,71.17 9.57,69.64 9.57,67.48 10.96,66.09 v10.96,65.45 | v10.96,63.17 R69.1
  Bottom 0.305: U$4.P$2 30.65,90.6 v28.74,92.5 | v10.96,92.38 v8.93,90.34 | v10.96,65.45 v10.96,63.17
N$80  (via drill 0.3)
  Top 0.305: R70.1 12.23,62.28 v13.12,63.17 | v13.12,65.2 13.12,65.71 13.88,66.47 13.88,79.8 v12.87,80.82 | v14.52,82.73 14.52,84.63 v15.66,85.77
  Bottom 0.305: v13.12,63.17 v13.12,65.2 | v12.87,80.82 12.87,81.07 v14.52,82.73 | v15.66,85.77 15.92,85.77 18.46,88.31 17.98,88.31 U$3.P$2
N$81  (via drill 0.3)
  Top 0.305: U$34.P$2 24.3,79.8 23.15,78.66 23.15,76.12 24.55,74.72 v24.55,69.26 | IC5.12 32.3,30.91 30.9,32.31 v29.38,32.31 | v22.14,47.16 v22.14,41.45 | v21.25,48.05 21.25,50.72 19.85,52.12 17.95,52.12 16.93,53.13 15.28,53.13 11.6,56.82 11.6,58.09 12.11,58.59 14.01,58.59 15.28,59.86 15.28,61.01 15.54,61.26 16.55,61.26 v18.71,63.42 | v23.03,67.74 v19.98,64.69 | v26.46,34.46 22.14,38.78 v22.14,40.18
  Bottom 0.305: v29.38,32.31 28.74,31.67 28.23,31.67 27.85,32.05 27.85,33.07 v26.46,34.46 | v22.14,41.45 v22.14,40.18 | v21.25,48.05 v22.14,47.16 | v19.98,64.69 v18.71,63.42 | v24.55,69.26 v23.03,67.74
N$82  (via drill 0.3)
  Top 0.305: R78.1 22.39,80.13 | 22.39,80.13 U$34.P$3 | U$36.TIP@3 7.48,84.3 v9.06,82.73 | v11.09,84.63 11.22,84.63 15.15,80.69 21.83,80.69 22.39,80.13
  Bottom 0.305: v9.06,82.73 9.18,82.73 v11.09,84.63
N$83  (via drill 0.3)
  Top 0.305: R80.2 32.93,53.13 34.71,54.91 36.74,54.91 v39.16,57.32 | v37.76,58.72 38.01,58.72 39.41,60.12 v49.06,60.12 | v55.03,62.15 63.54,62.15 v65.57,64.18 | v66.46,63.29 75.1,63.29 75.23,63.42 78.15,63.42 v79.16,62.4 | v80.31,63.29 78.78,64.82 78.78,68.5 v78.65,68.63 | v79.67,69.64 79.67,71.3 81.45,73.07 U$37.P$2
  Bottom 0.305: v37.76,58.72 v39.16,57.32 | v49.06,60.12 51.09,62.15 v55.03,62.15 | v66.46,63.29 v65.57,64.18 | v79.16,62.4 79.42,62.4 v80.31,63.29 | v79.67,69.64 v78.65,68.63
N$84
  Top 0.305: U$37.P$3 85.35,73.1 R84.1
N$85  (via drill 0.3)
  Top 0.305: R85.1 32.3,51.86 R81.1 36.24,51.99 38.14,53.9 40.43,53.9 v41.95,52.37 | v56.05,49.58 v45.76,49.58 | v57.57,51.1 57.57,51.74 61,55.17 83.23,55.17 v83.35,55.29 | v85.26,57.2 85.64,57.2 86.91,58.47 86.91,61.26 87.16,61.52 88.94,61.52 91.86,64.44 91.86,81.96 94.15,84.25 U$38.TIP@3 | v43.09,51.23 v44.49,49.83
  Bottom 0.305: v44.49,49.83 45.51,49.83 v45.76,49.58 | v57.57,51.1 v56.05,49.58 | v85.26,57.2 v83.35,55.29 | v41.95,52.37 v43.09,51.23
N$86
  Top 0.305: D3.1 7.12,51.89 U$14.TIP@3
N$91
  Top 0.305: U$42.2 57.83,20.11 R89.1 R92.2
N$93  (via drill 0.3)
  Top 0.305: U$42.6 R90.1 45.13,21.38 v44.36,22.15 | v42.97,23.04 38.01,23.04 R91.2
  Bottom 0.305: v44.36,22.15 43.86,22.15 v42.97,23.04
OSCSUM  (via drill 0.3)
  Top 0.305: R22.2 27.35,85.9 27.73,86.41 49.06,86.41 51.48,84 v51.48,80.82 | v51.35,78.41 51.35,78.28 52.24,77.39 52.24,70.15 53.76,68.63 53.76,61.39 v55.16,59.99 | v56.94,59.99 71.67,59.99 R51.2 73.83,57.83 82.97,57.83 83.86,58.72 v86.27,58.72 | U$40.TIP@3 94.15,65.96 88.81,60.63 v88.81,58.72 88.81,57.83 90.08,56.56 90.08,56.31 92.75,53.64 92.75,49.83 91.48,48.56 v91.48,40.05 | 77.13,16.56 U$15.9 80.18,16.56 81.58,15.16 86.53,15.16 87.29,15.92 87.29,20.5 88.69,21.89 88.69,37.26 v89.96,38.53
  Bottom 0.305: v51.48,80.82 51.48,78.53 v51.35,78.41 | v55.16,59.99 v56.94,59.99 | v88.81,58.72 v86.27,58.72 | v89.96,38.53 v91.48,40.05
PITCH_ENV  (via drill 0.3)
  Top 0.305: R67.2 27.22,27.99 IC5.8 v27.22,31.93 | R16.1 12.61,41.2 14.26,39.54 14.26,36.75 14.77,36.24 16.8,36.24 17.19,35.86 17.19,34.97 17.95,34.21 24.43,34.21 v25.82,32.81
  Bottom 0.305: v25.82,32.81 26.71,31.93 v27.22,31.93
PITCH_IN
  Top 0.305: R32.2 R31.2 R16.2 12.49,44.37 R11.1 10.96,45.89 R69.2 R70.2 R79.2 | IC7.15 18.2,44.37 R32.2 | R32.2 15.15,46.02 R13.1
PULSE_OUT
  Top 0.305: IC7.4 R40.1 R42.1
PWM_IN
  Top 0.305: IC7.5 R80.1 R85.2
R2_IN
  Top 0.305: U$28.P$2 81.45,42.85 R57.2
R_IN  (via drill 0.3)
  Top 0.305: R3.2 44.74,71.04 47.03,68.76 51.35,68.76 52.37,67.74 52.37,54.28 57.83,48.82 60.87,48.82 v61.26,48.43 | U$10.P$2 81.45,26.97 80.81,27.61 71.29,27.61 v71.03,27.35 | v71.03,29.51 67.1,29.51 66.84,29.77 66.84,33.2 63.16,36.88 63.16,43.61 61.26,45.51 v61.26,46.4
  Bottom 0.305: v71.03,27.35 v71.03,29.51 | v61.26,48.43 v61.26,46.4
RESONANCE_IN  (via drill 0.3)
  Top 0.305: U$6.P$2 66.84,14.14 67.61,14.91 68.75,14.91 69.51,15.67 69.51,17.96 68.75,18.72 67.99,18.72 67.48,19.23 v67.48,20.75 67.48,19.61 | R26.2 27.35,64.44 26.46,65.33 26.46,66.72 26.96,67.23 28.11,67.23 28.23,67.36 32.3,67.36 33.7,65.96 v33.7,64.95 | v35.22,63.42 35.22,62.4 33.31,60.5 33.31,58.72 33.57,58.47 36.87,58.47 37.12,58.72 37.12,58.98 37.63,59.48 v37.89,59.48 | v47.16,54.4 47.92,54.4 49.7,52.63 v49.7,50.21 | v53.13,46.78 53.63,46.78 54.78,45.64 54.78,42.85 55.92,41.7 v57.83,41.7 | v58.71,40.81 58.71,32.56 58.46,32.31 58.46,29.77 v60.49,27.73 | v64.81,23.42 v61.51,26.72 | v42.2,53.77 40.43,55.55 v40.43,55.8
  Bottom 0.305: v35.22,63.42 v33.7,64.95 | v37.89,59.48 39.92,57.45 39.92,56.31 v40.43,55.8 | v53.13,46.78 v49.7,50.21 | v58.71,40.81 v57.83,41.7 | v61.51,26.72 v60.49,27.73 | v67.48,20.75 v64.81,23.42 | v47.16,54.4 46.4,54.4 45.76,53.77 v42.2,53.77
S2_IN  (via drill 0.3)
  Top 0.305: v68.11,46.78 68.11,45.77 68.75,45.13 U$27.P$2 | IC4.9 v70.53,66.22 | v70.53,62.53 70.53,61.52 v70.91,61.13 | v68.11,48.31 70.78,50.97 70.78,52.63 70.02,53.39 v68.62,53.39
  Bottom 0.305: v70.53,66.22 v70.53,62.53 | v70.91,61.13 71.16,60.88 71.16,55.93 v68.62,53.39 | v68.11,46.78 v68.11,48.31
S_IN  (via drill 0.3)
  Top 0.305: IC1.9 48.17,82.73 47.03,81.58 47.03,79.55 47.67,78.92 49.82,78.92 51.6,77.14 51.6,69.77 53.13,68.25 53.13,54.66 58.21,49.58 61.51,49.58 v62.65,48.43 | v62.78,46.4 62.78,45.26 63.92,44.12 63.92,37.13 67.86,33.2 v67.86,30.53 | U$9.P$2 68.37,25.23 68.34,25.23 67.86,25.7 v67.86,27.35
  Bottom 0.305: v62.65,48.43 62.65,46.53 v62.78,46.4 | v67.86,27.35 v67.86,30.53
SAWTOOTH_OUT  (via drill 0.3)
  Top 0.305: IC7.8 27.73,60.75 28.74,59.74 28.74,58.72 29.25,58.21 31.03,58.21 32.05,57.2 38.14,57.2 38.9,57.96 46.27,57.96 v46.78,57.45 | v47.79,56.44 v51.6,56.44 | v56.94,58.34 56.94,57.83 57.57,57.2 83.48,57.2 v84.12,57.83 | v84.12,59.48 84.88,59.48 R41.1
  Bottom 0.305: v46.78,57.45 v47.79,56.44 | v51.6,56.44 55.03,56.44 v56.94,58.34 | v84.12,57.83 v84.12,59.48
TRIANGLE_OUT
  Top 0.305: IC7.10 R43.1